# EAGLE design carte_ascenseur (EAGLE 6.1)
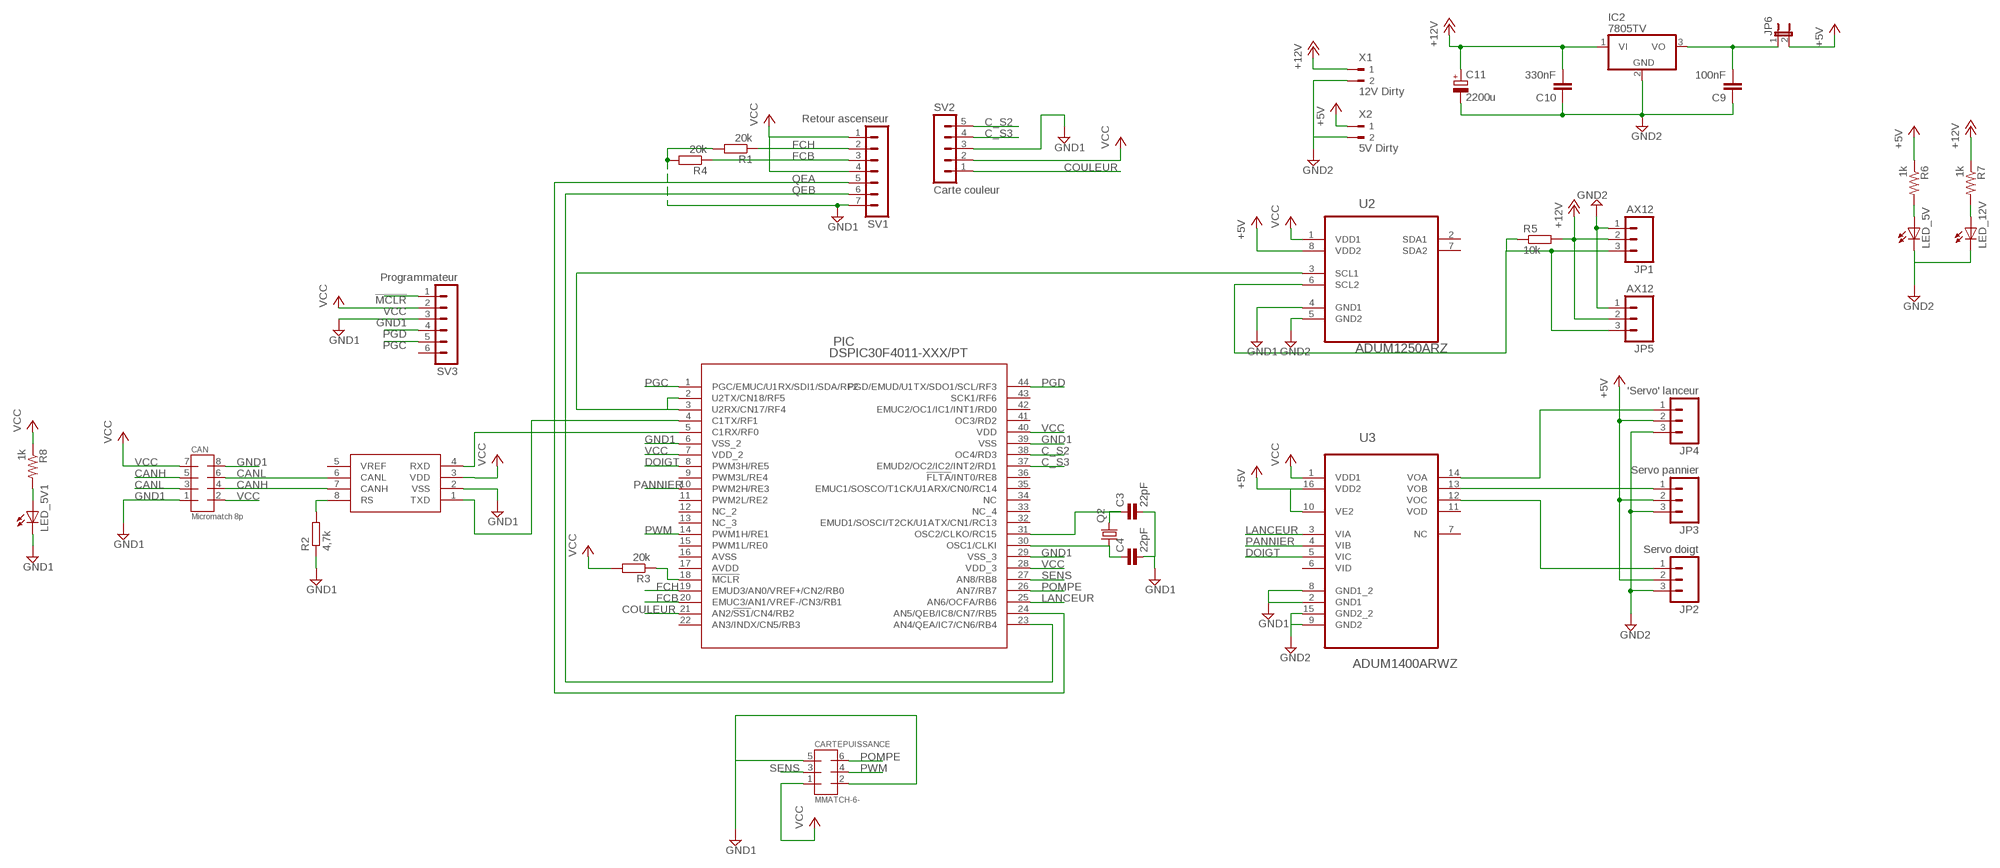
[diagram p0: schematic, sheet 1]

## Parts
C3  22pF  C0805  [0805]
C4  22pF  C0805  [0805]
C9  100nF  C-EUC0805  [C0805]
C10  330nF  C-EUC0805  [C0805]
C11  2200u  CPOL-EUTT5D11  [TT5D11]
CAN  Micromatch 8p  MMATCH-8-PTH  [AMP-215079-8]
CARTEPUISSANCE  MMATCH-6-  [AMP-215079-6]
IC2  7805TV  [TO220V]
JP1  AX12  M03POLAR  [MOLEX-1X3]
JP2  Servo doigt  M03PTH  [1X03]
JP3  Servo pannier  M03PTH  [1X03]
JP4  'Servo' lanceur  M03PTH  [1X03]
JP5  AX12  M03POLAR  [MOLEX-1X3]
JP6  JP1E  [JP1]
LED_5V  LEDCHIPLED_0805  [CHIPLED_0805]
LED_5V1  LEDCHIPLED_0805  [CHIPLED_0805]
LED_12V  LEDCHIPLED_0805  [CHIPLED_0805]
PIC  DSPIC30F4011-XXX/PT  [TQFP44_MC]
Q2  CRYSTALHC49S  [HC49/S]
R1  20k  R-EU_M0805  [M0805]
R2  4,7k  R-EU_M0805  [M0805]
R3  20k  R-EU_M0805  [M0805]
R4  20k  R-EU_M0805  [M0805]
R5  10k  R-EU_M0805  [M0805]
R6  1k  RESISTOR0805-RES  [0805]
R7  1k  RESISTOR0805-RES  [0805]
R8  1k  RESISTOR0805-RES  [0805]
SV1  Retour ascenseur  MA07-1  [MA07-1]
SV2  Carte couleur  MA05-1  [MA05-1]
SV3  Programmateur  MA06-1  [MA06-1]
U1  MCP2551  [SO08]
U2  ADUM1250ARZ  [SOIC127P600X175-8N]
U3  ADUM1400ARWZ  [SOIC127P1032X265-16N]
X1  12V Dirty  90-2  [90-2]
X2  5V Dirty  90-2  [90-2]

## Nets
!MCLR!: PIC.18(!MCLR!) R3.1 SV3.1
+5V: JP2.2 JP3.2 JP4.2 JP6.2 R6.1 U2.8(VDD2) U3.10(VE2) U3.16(VDD2) X2.1
+12V: C10.2 C11.+ IC2.1(VI) JP1.2 JP5.2 R5.2 R7.1 X1.1
C_S2: PIC.38(OC4/RD3) SV2.5
C_S3: PIC.37(EMUD2/OC2/IC2/INT2/RD1) SV2.4
CANH: CAN.4 CAN.5 U1.7(CANH)
CANL: CAN.3 CAN.6 U1.6(CANL)
COULEUR: PIC.21(AN2/!SS1!/CN4/RB2) SV2.1
DOIGT: PIC.8(PWM3H/RE5) U3.5(VIC)
FCB: PIC.20(EMUC3/AN1/VREF-/CN3/RB1) R4.1 SV1.3
FCH: PIC.19(EMUD3/AN0/VREF+/CN2/RB0) R1.1 SV1.2
GND1: C3.2 C4.2 CAN.1 CAN.8 CARTEPUISSANCE.2 CARTEPUISSANCE.5 LED_5V1.C PIC.6(VSS_2) PIC.29(VSS_3) PIC.39(VSS) R1.2 R2.1 R4.2 SV1.7 SV2.3 SV3.3 U1.2(VSS) U2.4(GND1) U3.2(GND1) U3.8(GND1_2)
GND2: C9.1 C10.1 C11.- IC2.2(GND) JP1.1 JP2.3 JP3.3 JP4.3 JP5.1 LED_5V.C LED_12V.C U2.5(GND2) U3.9(GND2) U3.15(GND2_2) X1.2 X2.2
LANCEUR: PIC.25(AN6/OCFA/RB6) U3.3(VIA)
N$1: PIC.4(C1TX/RF1) U1.1(TXD)
N$2: LED_5V.A R6.2
N$3: PIC.5(C1RX/RF0) U1.4(RXD)
N$4: R2.2 U1.8(RS)
N$6: C9.2 IC2.3(VO) JP6.1
N$7: PIC.2(U2TX/CN18/RF5) PIC.3(U2RX/CN17/RF4) U2.3(SCL1)
N$8: JP4.1 U3.14(VOA)
N$9: JP3.1 U3.13(VOB)
N$10: JP2.1 U3.12(VOC)
N$11: LED_12V.A R7.2
N$12: LED_5V1.A R8.2
N$15: C3.1 PIC.31(OSC2/CLKO/RC15) Q2.2
N$16: JP1.3 JP5.3 R5.1 U2.6(SCL2)
N$18: C4.1 PIC.30(OSC1/CLKI) Q2.1
PANNIER: PIC.10(PWM2H/RE3) U3.4(VIB)
PGC: PIC.1(PGC/EMUC/U1RX/SDI1/SDA/RF2) SV3.5
PGD: PIC.44(PGD/EMUD/U1TX/SDO1/SCL/RF3) SV3.4
POMPE: CARTEPUISSANCE.6 PIC.26(AN7/RB7)
PWM: CARTEPUISSANCE.4 PIC.14(PWM1H/RE1)
QEA: PIC.24(AN5/QEB/IC8/CN7/RB5) SV1.5
QEB: PIC.23(AN4/QEA/IC7/CN6/RB4) SV1.6
SENS: CARTEPUISSANCE.3 PIC.27(AN8/RB8)
VCC: CAN.2 CAN.7 CARTEPUISSANCE.1 PIC.7(VDD_2) PIC.28(VDD_3) PIC.40(VDD) R3.2 R8.1 SV1.1 SV1.4 SV2.2 SV3.2 U1.3(VDD) U2.1(VDD1) U3.1(VDD1)
Unconnected: PIC.9(PWM3L/RE4) PIC.11(PWM2L/RE2) PIC.12(NC_2) PIC.13(NC_3) PIC.15(PWM1L/RE0) PIC.16(AVSS) PIC.17(AVDD) PIC.22(AN3/INDX/CN5/RB3) PIC.32(EMUD1/SOSCI/T2CK/U1ATX/CN1/RC13) PIC.33(NC_4) PIC.34(NC) PIC.35(EMUC1/SOSCO/T1CK/U1ARX/CN0/RC14) PIC.36(!FLTA!/INT0/RE8) PIC.41(OC3/RD2) PIC.42(EMUC2/OC1/IC1/INT1/RD0) PIC.43(SCK1/RF6) SV3.6 U1.5(VREF) U2.2(SDA1) U2.7(SDA2) U3.6(VID) U3.7(NC) U3.11(VOD)

## Library data of the parts
C3 C4 = mbed-rlcq:C
C9 C10 = rcl:C-EU: CAPACITOR, European symbol
C11 = rcl:CPOL-EU: POLARIZED CAPACITOR, European symbol
CAN = jt-con-micromatch:MMATCH-8-*: AMP Micromatch 8-pin
CARTEPUISSANCE = jt-con-micromatch:MMATCH-6-*
IC2 = linear:78*: Positive VOLTAGE REGULATOR Source: http://cache.national.com/ds/LM/LM78L05.pdf http://www.fairchildsemi.com/ds/LM/LM7805.pdf
JP1-JP5 = SparkFun-Connectors:M03: Header 3 Standard 3-pin 0.1" header. Use with straight break away headers (SKU : PRT-00116), right angle break away headers (PRT-00553), swiss pins (PRT-00743), machine pins (PRT-00117), and female headers (PRT-00115). Molex polarized connector foot print use with SKU : PRT-08232 with associated crimp pins and housings.
JP6 = jumper:JP1E: JUMPER
LED_5V LED_5V1 LED_12V = adafruit:LED: LED OSRAM: - CHIPLED LG R971, LG N971, LY N971, LG Q971, LY Q971, LO R971, LY R971 LH N974, LH R974 LS Q976, LO Q976, LY Q976 LO Q996 - Hyper CHIPLED LW Q18S LB Q993, LB Q99A, LB R99A - SideLED LS A670, LO A670, LY A670, LG A670, LP A670 LB A673, LV A673, LT A673, LW A673 LH A674 LY A675 LS A676, LA A676, LO A676, LY A676, LW A676 LS A679, LY A679, LG A679 - Hyper Micro SIDELED® LS Y876, LA Y876, LO Y876, LY Y876 LT Y87S - SmartLED LW L88C, LW L88S LB L89C, LB L89S, LG L890 LS L89K, LO L89K, LY L89K LS L896, LA L896, LO L896, LY L896 - TOPLED LS T670, LO T670, LY T670, LG T670, LP T670 LSG T670, LSP T670, LSY T670, LOP T670, LYG T670 LG T671, LOG T671, LSG T671 LB T673, LV T673, LT T673, LW T673 LH T674 LS T676, LA T676, LO T676, LY T676, LB T676, LH T676, LSB T676, LW T676 LB T67C, LV T67C, LT T67C, LS T67K, LO T67K, LY T67K, LW E67C LS E67B, LA E67B, LO E67B, LY E67B, LB E67C, LV E67C, LT E67C LW T67C LS T679, LY T679, LG T679 LS T770, LO T770, LY T770, LG T770, LP T770 LB T773, LV T773, LT T773, LW T773 LH T774 LS E675, LA E675, LY E675, LS T675 LS T776, LA T776, LO T776, LY T776, LB T776 LHGB T686 LT T68C, LB T68C - Hyper Mini TOPLED® LB M676 - Mini TOPLED Santana® LG M470 LS M47K, LO M47K, LY M47K Source: http://www.osram.convergy.de/
PIC = UL-PIC:DSPIC30F4011-XXX/PT
Q2 = crystal:CRYSTAL: CRYSTAL; OC_FARNELL: 1667008; OC_NEWARK: unknown
R1-R5 = rcl:R-EU_: RESISTOR, European symbol
R6-R8 = SparkFun-Passives:RESISTOR: Resistor Basic schematic elements and footprints for 0603, 1206, and PTH resistors.; OC_FARNELL: unknown
SV1 = con-lstb:MA07-1: PIN HEADER; OC_FARNELL: unknown; OC_NEWARK: unknown
SV2 = con-lstb:MA05-1: PIN HEADER; OC_FARNELL: unknown; OC_NEWARK: unknown
SV3 = con-lstb:MA06-1: PIN HEADER; OC_FARNELL: unknown; OC_NEWARK: unknown
U1 = SparkFun-DigitalIC:MCP2551: CAN transceiver
U2 = Analog Devices_By_element14_Batch_1:ADUM1250ARZ: Hot Swappable, Dual I2C Isolators; MPN: ADUM1250ARZ; OC_FARNELL: 1814353; OC_NEWARK: 27M9880; PACKAGE: SOIC-8; SUPPLIER: Analog Devices
U3 = Analog Devices_By_element14_Batch_1:ADUM1400ARWZ: Quad-Channel Digital Isolators; MPN: ADUM1400ARWZ; OC_FARNELL: 1226217; OC_NEWARK: 19M8755; PACKAGE: SOIC-16; SUPPLIER: Analog Devices
X1 X2 = con-weidmueller-sl35:90-2: WEIDMUELLER CLAMP CONNECTOR; OC_FARNELL: unknown; OC_NEWARK: unknown

## Board
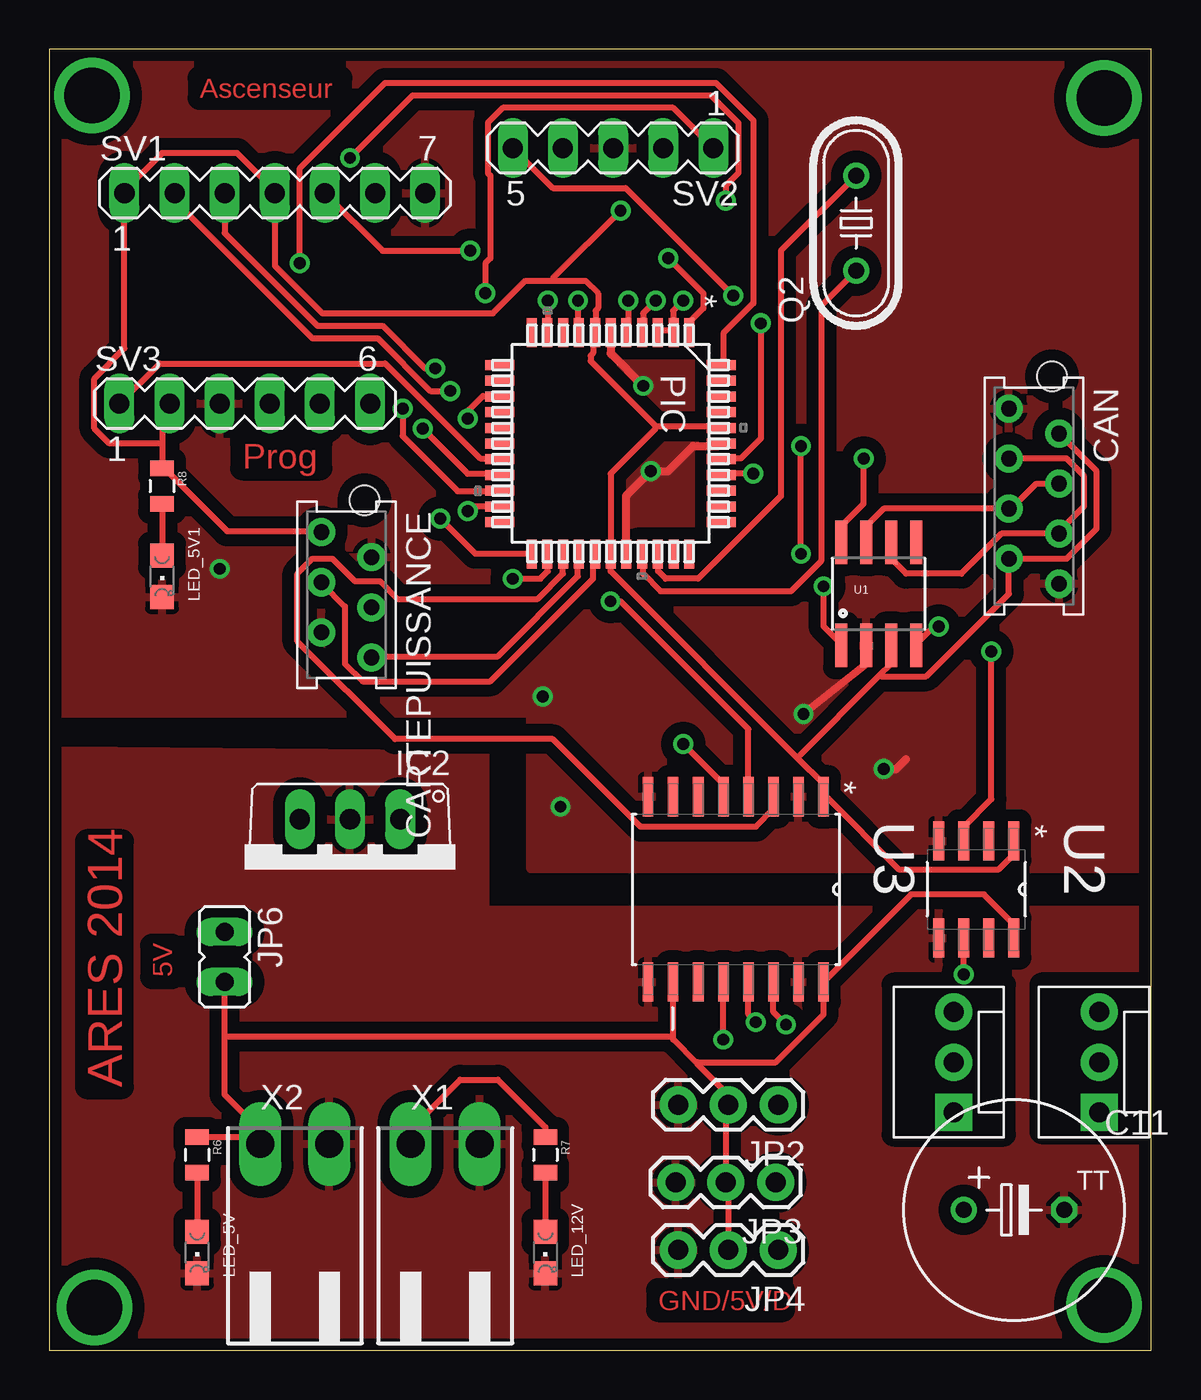
[diagram p1: board, top side]
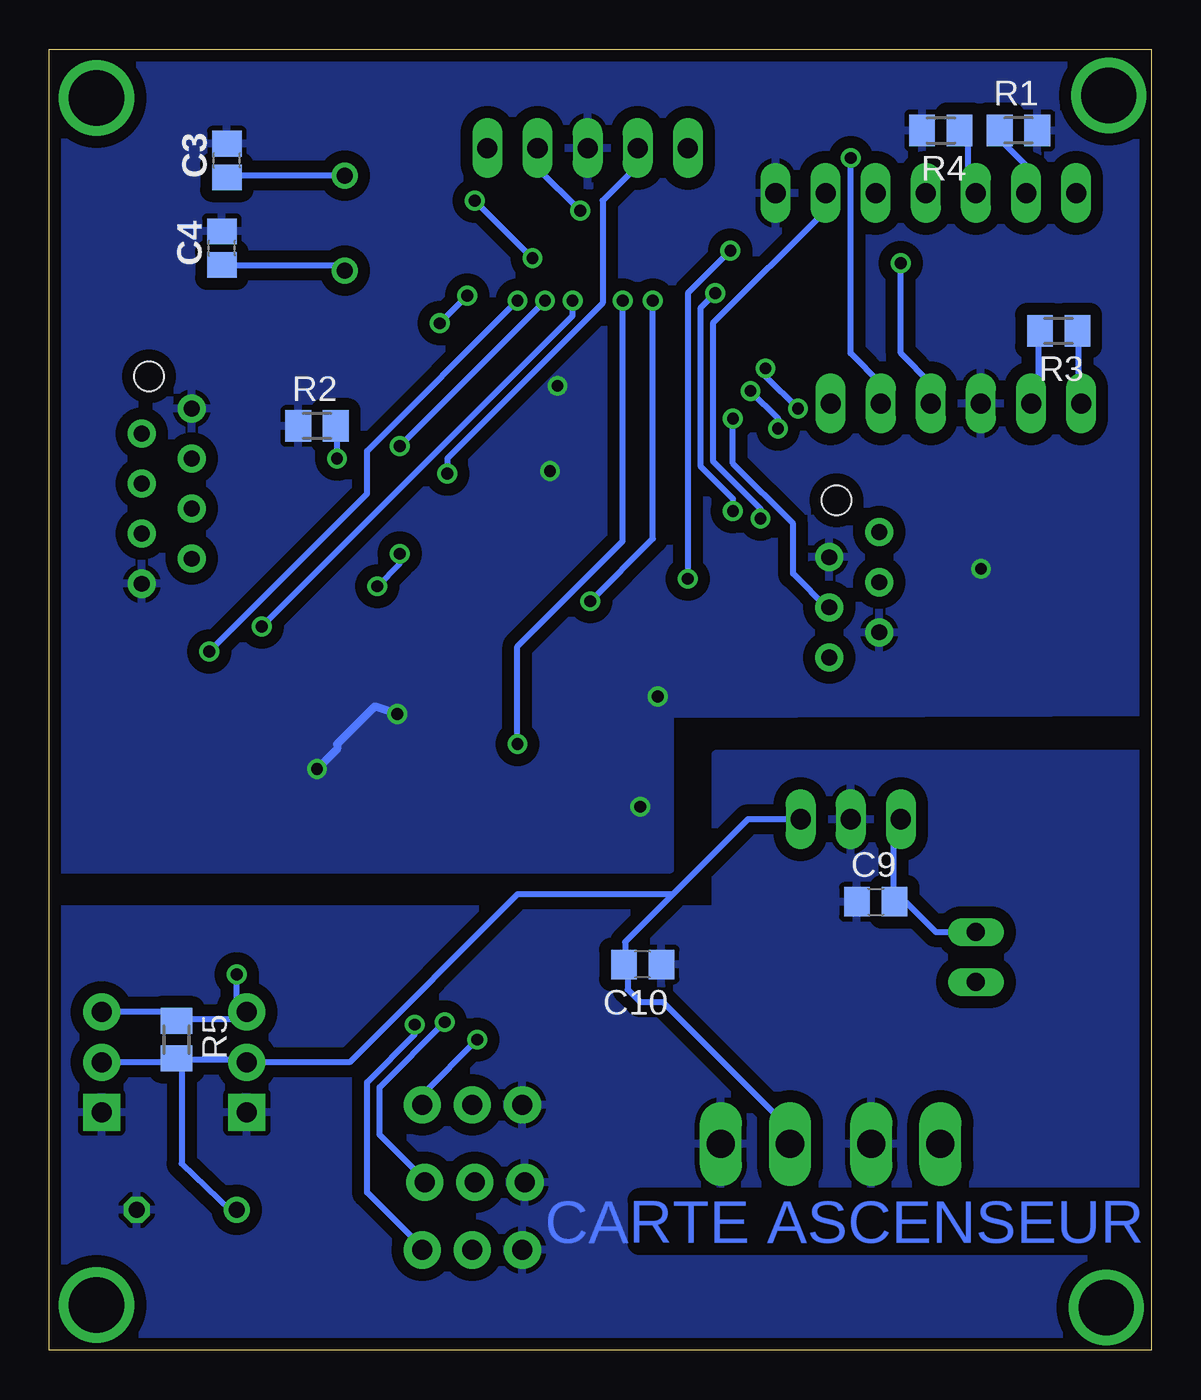
[diagram p2: board, bottom side, seen from below]

Size 55.86 x 65.96 mm. Coordinates in mm from the lower left corner, seen from the top.
Outline: 0,0 55.86,0 55.86,65.96 0,65.96 0,0
Copper layers (1*16): Top 0.035mm / dielectric 1.5mm / Bottom 0.035mm
Design rules "default": minimum track width 0.3mm, minimum drill 0.6mm, track to track 0.3mm, track to pad 0.3mm, pad to pad 0.3mm, via to via 0.3mm, smd to smd 8mil, copper to edge 0.4mm, drill to drill 8mil, minimum pad ring 10mil, minimum via ring 8mil, stop-mask expansion 4mil, vias tented up to drill 0mil, thermal gap 10mil
tRestrict: area 42.8,10.9 to 48.4,18.5; area 50.3,11 to 55.9,18.5
vRestrict: area 39.8,36.6 to 44.3,40.4; area 29.6,19.6 to 40.1,27.2; area 44.5,21.3 to 49.4,25.4; area 22.1,39.6 to 34.8,52.3

### Footprints (pad centres in the part's own frame; a part is rotated, then mirrored left to right if it is on the bottom)
0805 = smd 1.3 x 1.5: 1 -0.85,0; 2 0.85,0
C0805 = smd 1.3 x 1.5: 1 -0.95,0; 2 0.95,0
TT5D11 = drill 0.813: + -2.54,0 | drill 0.813 octagon: - 2.54,0
AMP-215079-8 = drill 0.8 pad 1.422: 1 0,-1.27; 2 1.27,1.27; 3 2.54,-1.27; 4 3.81,1.27; 5 5.08,-1.27; 6 6.35,1.27; 7 7.62,-1.27; 8 8.89,1.27 | hole 1.5: -1.62,0.905
AMP-215079-6 = drill 0.8 pad 1.422: 1 0,0; 2 1.27,2.54; 3 2.54,0; 4 3.81,2.54; 5 5.08,0; 6 6.35,2.54 | hole 1.5: -1.62,2.175
TO220V = drill 1.016 long: 1 -2.54,-2.54; 2 0,-2.54; 3 2.54,-2.54
MOLEX-1X3 = drill 1.016 pad 1.88 square: 1 0,0 | drill 1.016 pad 1.88: 2 2.54,0; 3 5.08,0
1X03 = drill 1.016 pad 1.88: 1 0,0; 2 2.54,0; 3 5.08,0
JP1 = drill 0.914 long: 1 0,-1.27; 2 0,1.27
CHIPLED_0805 = smd 1.2 x 1.2: A 0,-1.05; C 0,1.05
TQFP44_MC = smd 1.473 x 0.508: 1 -5.613,3.988; 2 -5.613,3.2; 3 -5.613,2.388; 4 -5.613,1.6; 5 -5.613,0.787; 6 -5.613,0; 7 -5.613,-0.787; 8 -5.613,-1.6; 9 -5.613,-2.388; 10 -5.613,-3.2; 11 -5.613,-3.988; 23 5.613,-3.988; 24 5.613,-3.2; 25 5.613,-2.388; 26 5.613,-1.6; 27 5.613,-0.787; 28 5.613,0; 29 5.613,0.787; 30 5.613,1.6; 31 5.613,2.388; 32 5.613,3.2; 33 5.613,3.988 | smd 0.508 x 1.473: 12 -3.988,-5.613; 13 -3.2,-5.613; 14 -2.388,-5.613; 15 -1.6,-5.613; 16 -0.787,-5.613; 17 0,-5.613; 18 0.787,-5.613; 19 1.6,-5.613; 20 2.388,-5.613; 21 3.2,-5.613; 22 3.988,-5.613; 34 3.988,5.613; 35 3.2,5.613; 36 2.388,5.613; 37 1.6,5.613; 38 0.787,5.613; 39 0,5.613; 40 -0.787,5.613; 41 -1.6,5.613; 42 -2.388,5.613; 43 -3.2,5.613; 44 -3.988,5.613
HC49/S = drill 0.813: 1 -2.413,0; 2 2.413,0
M0805 = smd 1.3 x 1.6: 1 -0.95,0; 2 0.95,0
0805' = smd 0.8 x 1.2: 1 -0.9,0; 2 0.9,0
MA07-1 = drill 1.016 long: 1 -7.62,0; 2 -5.08,0; 3 -2.54,0; 4 0,0; 5 2.54,0; 6 5.08,0; 7 7.62,0
MA05-1 = drill 1.016 long: 1 -5.08,0; 2 -2.54,0; 3 0,0; 4 2.54,0; 5 5.08,0
MA06-1 = drill 1.016 long: 1 -6.35,0; 2 -3.81,0; 3 -1.27,0; 4 1.27,0; 5 3.81,0; 6 6.35,0
SO08 = smd 0.61 x 2.21: 1 -1.905,-2.616; 2 -0.635,-2.616; 3 0.635,-2.616; 4 1.905,-2.616; 5 1.905,2.616; 6 0.635,2.616; 7 -0.635,2.616; 8 -1.905,2.616
SOIC127P600X175-8N = smd 1.981 x 0.559: 1 -2.464,1.905; 2 -2.464,0.635; 3 -2.464,-0.635; 4 -2.464,-1.905; 5 2.464,-1.905; 6 2.464,-0.635; 7 2.464,0.635; 8 2.464,1.905
SOIC127P1032X265-16N = smd 1.981 x 0.533: 1 -4.699,4.445; 2 -4.699,3.175; 3 -4.699,1.905; 4 -4.699,0.635; 5 -4.699,-0.635; 6 -4.699,-1.905; 7 -4.699,-3.175; 8 -4.699,-4.445; 9 4.699,-4.445; 10 4.699,-3.175; 11 4.699,-1.905; 12 4.699,-0.635; 13 4.699,0.635; 14 4.699,1.905; 15 4.699,3.175; 16 4.699,4.445
90-2 = drill 1.422 long: 1 -1.75,5.25; 2 1.75,5.25

### Placement (x,y rotation side)
C3  46.86,60.32 90 bottom
C4  47.12,55.88 90 bottom
C9  13.97,22.73 0 bottom
C10  25.78,19.56 180 bottom
C11  48.89,7.11 0 top
CAN  49.91,47.75 270 top
CARTEPUISSANCE  13.79,41.48 270 top
IC2  15.24,24.38 180 top
JP1  53.21,12.06 90 top
JP2  36.96,12.45 180 top
JP3  36.83,8.51 180 top
JP4  36.96,5.08 180 top
JP5  45.85,12.06 90 top
JP6  8.89,19.94 180 top
LED_5V  7.49,4.95 180 top
LED_5V1  5.71,39.24 180 top
LED_12V  25.15,4.95 180 top
PIC  28.45,45.97 270 top
Q2  40.89,57.15 90 top
R1  6.73,61.85 0 bottom
R2  42.29,46.86 0 bottom
R3  4.7,51.69 180 bottom
R4  10.67,61.85 180 bottom
R5  49.4,15.75 270 bottom
R6  1k  [0805']  7.49,9.91 270 top
R7  1k  [0805']  25.15,9.91 270 top
R8  1k  [0805']  5.71,43.81 270 top
SV1  11.43,58.67 0 top
SV2  28.57,60.96 180 top
SV3  9.91,48.01 0 top
U1  42.04,38.35 0 top
U2  46.99,23.37 270 top
U3  34.8,23.37 270 top
X1  20.07,5.21 0 top
X2  12.45,5.21 0 top

### Tracks (layer width: path | path; a pad name or v marks a point on that pad's centre or on a via)
!MCLR!
  Top 0.3: SV3.1 5.59,50.04 17.02,50.04 21.84,45.21 22.73,45.21 PIC.18
  Bottom 0.3: SV3.1 3.68,48.13 3.68,51.69 R3.1
+5V
  Top 0.3: R6.1 7.49,10.79 10.41,10.79 10.67,10.54 X2.1 9.91,10.92 9.91,11.94 8.89,12.95 8.89,15.88 | 8.89,15.88 JP6.2 | U2.8 48.89,21.59 47.37,23.11 43.69,23.11 U3.16 39.24,17.02 36.83,14.61 32.89,14.61 32.83,14.54 | 31.62,15.88 31.62,15.75 32.83,14.54 | 31.62,15.88 U3.10 | 32.83,14.54 34.42,12.95 JP2.2 34.29,12.45 JP3.2 34.42,8.51 JP4.2 | 31.62,15.88 8.89,15.88
+12V
  Top 0.3: R7.1 25.15,11.3 22.73,13.72 20.83,13.72 18.42,11.3 18.42,10.54 X1.1
  Bottom 0.3: R5.2 49.4,14.73 45.97,14.73 JP5.2 40.64,14.61 32.13,23.11 24.38,23.11 24.32,23.05 | C11.+ 46.68,7.1 49.15,9.46 49.15,14.61 R5.2 | JP1.2 49.4,14.61 R5.2 | 24.32,23.05 20.45,26.92 IC2.1 | 24.32,23.05 26.67,20.7 26.67,19.56 C10.2 26.54,19.56 26.54,18.29 25.91,17.65 24.76,17.65 18.42,11.3 18.42,10.54 X1.1
C_S2  (via drill 0.6)
  Top 0.3: v36.07,52.07 36.07,46.23 35.05,45.21 34.16,45.21 PIC.38 | v34.67,53.47 29.21,58.93 25.53,58.93 SV2.5
  Bottom 0.3: v34.67,53.47 v36.07,52.07
C_S3  (via drill 0.6)
  Top 0.3: v35.69,44.45 34.16,44.45 PIC.37
  Bottom 0.3: v35.69,44.45 35.69,45.21 27.81,53.09 27.81,58.29 26.04,60.07 SV2.4
CANH
  Top 0.3: U1.7 41.4,41.78 42.29,42.67 CAN.5 48.77,42.67 50.04,43.94 CAN.4
CANL
  Top 0.3: U1.6 42.67,40.13 43.43,39.37 46.23,39.37 48.26,41.4 CAN.6 51.18,41.53 52.45,42.8 52.45,44.32 51.56,45.21 CAN.3
COULEUR  (via drill 0.6)
  Top 0.3: v21.21,42.55 21.46,42.8 22.73,42.8 PIC.21 | v22.1,53.59 22.1,55.12 22.35,55.37 22.35,59.56 22.22,59.69 22.22,62.23 22.99,62.99 31.62,62.99 SV2.1
  Bottom 0.3: v21.21,42.55 21.21,43.18 22.86,44.83 22.86,52.83 v22.1,53.59
DOIGT  (via drill 0.6)
  Top 0.3: v26.8,53.21 26.8,51.69 PIC.8 | v32.13,30.73 34.16,28.7 U3.5
  Bottom 0.3: v26.8,53.21 26.8,41.02 32.13,35.69 v32.13,30.73
FCB  (via drill 0.6)
  Top 0.3: v17.91,47.75 17.91,46.35 20.7,43.56 22.73,43.56 PIC.20 | v19.56,49.78 19.05,49.78 16.89,51.94 13.59,51.94 8.89,56.64 SV1.3
  Bottom 0.3: v17.91,47.75 19.56,49.4 v19.56,49.78 | SV1.3 9.27,59.05 9.27,62.36 R4.1
FCH  (via drill 0.6)
  Top 0.3: v18.92,46.74 21.21,44.45 22.73,44.45 PIC.19 | v20.32,48.64 19.3,48.64 16.64,51.31 13.33,51.31 6.35,58.29 SV1.2
  Bottom 0.3: v18.92,46.74 18.92,47.24 v20.32,48.64 | SV1.2 6.35,60.07 7.62,61.34 7.62,61.85 R1.1
GND1  (via drill 0.6)
  Top 0.406: U1.2 41.4,34.8 v38.23,32.26 | v42.29,29.46 42.93,29.46 43.43,29.97 | PIC.29 29.24,43.33 v30.48,44.58 31.37,44.58 32.64,45.85 33.93,45.85 PIC.39 | PIC.6 28.45,50.55 v30.1,48.89
  Bottom 0.406: v38.23,32.26 39.37,32.64 41.28,30.73 41.28,30.48 v42.29,29.46
  other vias: 25.91,27.56 25.02,33.15 8.64,39.62
  pour Bottom (isolate 0.61): -7.87,68.45 57.15,68.33 57.15,24.38 24.38,24.38 24.38,32.26 -7.87,32.38
  pour Top (isolate 0.61): -1.78,68.33 57.15,68.33 57.15,24.38 24.38,24.38 24.38,32.26 -1.78,32.26
GND2
  pour Bottom (isolate 0.61): -1.78,30.23 22.1,30.23 22.1,22.35 57.15,22.35 57.15,-1.02 -1.78,-1.02
  pour Top (isolate 0.61): -4.57,30.48 22.1,30.23 22.1,22.35 57.15,22.35 57.15,-1.02 -1.78,-1.02
LANCEUR
  Top 0.3: U3.3 36.7,27.43 35.81,26.54 29.97,26.54 25.53,30.99 17.53,30.99 12.57,35.94 12.57,39.37 13.33,40.13 14.35,40.13 15.49,38.99 16.76,38.99 17.65,38.1 24.76,38.1 26.04,39.37 26.04,40.26 PIC.25
N$1  (via drill 0.6)
  Top 0.3: v30.73,53.21 30.1,52.58 30.1,51.69 PIC.4 | v38.1,40.39 v38.1,45.85 | v39.24,38.73 39.24,36.7 40.13,35.81 U1.1
  Bottom 0.3: v38.1,45.85 v30.73,53.21 | v38.1,40.39 38.1,39.88 v39.24,38.73
N$2
  Top 0.3: R6.2 LED_5V.A
N$3  (via drill 0.6)
  Top 0.3: v29.34,53.21 29.34,51.69 PIC.5 | v45.08,36.7 44.83,36.7 43.94,35.81 U1.4
  Bottom 0.3: v29.34,53.21 29.34,52.45 v45.08,36.7
N$4  (via drill 0.6)
  Top 0.3: v41.28,45.21 41.28,42.93 40.13,41.78 U1.8
  Bottom 0.3: v41.28,45.21 41.28,46.86 R2.2
N$6
  Bottom 0.3: IC2.3 13.08,26.54 13.08,22.73 C9.2 12.95,23.24 10.92,21.21 JP6.1
N$7  (via drill 0.6)
  Top 0.3: PIC.3 30.86,51.69 31.62,51.69 PIC.2 31.62,51.82 31.62,52.7 v32.13,53.21 | v47.75,35.43 47.75,27.94 46.35,26.54 U2.3
  Bottom 0.3: v32.13,53.21 39.75,45.59 39.75,43.43 v47.75,35.43
N$8  (via drill 0.6)
  Top 0.3: U3.14 36.7,17.14 v37.34,16.51
  Bottom 0.3: v37.34,16.51 37.34,16 39.75,13.59 39.75,8 36.96,5.21 JP4.1
N$9  (via drill 0.6)
  Top 0.3: U3.13 35.43,17.02 v35.81,16.64
  Bottom 0.3: v35.81,16.64 39.12,13.34 39.12,10.92 36.83,8.64 JP3.1
N$10  (via drill 0.6)
  Top 0.3: v34.16,15.75 U3.12
  Bottom 0.3: v34.16,15.75 36.96,12.95 JP2.1
N$11
  Top 0.3: R7.2 LED_12V.A
N$12
  Top 0.3: R8.2 LED_5V1.A
N$15
  Top 0.3: Q2.2 37.08,55.75 37.08,43.31 32.89,39.12 31.24,39.12 30.86,39.5 30.86,40.26 PIC.31
  Bottom 0.3: Q2.2 46.86,59.56 C3.1
N$16  (via drill 0.6)
  Top 0.3: v46.35,19.05 U2.6
  Bottom 0.3: v46.35,19.05 46.35,16.89 JP5.3 46.23,16.76 49.4,16.76 R5.1 49.53,16.76 49.91,17.14 JP1.3
N$18
  Top 0.3: Q2.1 39.12,52.96 39.12,40 37.59,38.48 30.99,38.48 30.1,39.37 30.1,40.26 PIC.30
  Bottom 0.3: Q2.1 41.15,54.99 47.12,54.99 C4.1
N$20  (via drill 2.8)
  other vias: 53.47,63.5
N$21  (via drill 2.8)
  other vias: 53.47,2.29
N$22  (via drill 2.8)
  other vias: 2.29,2.16
N$23  (via drill 2.8)
  other vias: 2.16,63.63
PANNIER  (via drill 0.6)
  Top 0.3: v25.27,53.21 25.27,51.69 PIC.10 | v28.45,37.97 28.96,37.97 35.43,31.5 U3.4
  Bottom 0.3: v25.27,53.21 25.27,41.15 v28.45,37.97
PGC  (via drill 0.6)
  Top 0.3: v31.37,55.37 33.15,53.59 33.15,52.83 32.51,52.2 32.51,51.69 PIC.1 | v34.29,58.29 34.29,59.05 34.92,59.69 34.92,62.23 33.53,63.63 18.42,63.63 v15.24,60.45
  Bottom 0.3: v34.29,58.29 v31.37,55.37 | v15.24,60.45 15.24,50.55 13.72,49.02 SV3.5
PGD  (via drill 0.6)
  Top 0.3: v12.7,55.12 12.7,59.94 17.02,64.26 33.78,64.26 35.69,62.36 35.69,53.09 34.16,51.56 34.16,50.04 PIC.44
  Bottom 0.3: v12.7,55.12 12.7,50.55 11.18,49.02 SV3.4
POMPE
  Top 0.3: PIC.26 26.8,40.26 26.8,39.24 22.73,35.18 16.38,35.18 CARTEPUISSANCE.6
PWM  (via drill 0.6)
  Top 0.3: v21.21,47.24 21.21,47.62 21.97,48.39 22.73,48.39 PIC.14
  Bottom 0.3: v21.21,47.24 21.21,44.96 18.16,41.91 18.16,39.37 16.38,37.59 CARTEPUISSANCE.4
QEA  (via drill 0.6)
  Top 0.3: v23.5,39.12 24.89,39.12 25.27,39.5 25.27,40.26 PIC.24 | v21.34,55.75 16.89,55.75 SV1.5
  Bottom 0.3: v23.5,39.12 23.5,53.59 v21.34,55.75
QEB  (via drill 0.6)
  Top 0.3: v19.81,42.16 21.59,40.39 24.38,40.39 PIC.23
  Bottom 0.3: v19.81,42.16 19.81,42.67 22.22,45.09 22.22,52.07 16.51,57.78 SV1.6
SENS
  Top 0.3: PIC.27 27.56,40.26 27.56,39.12 22.35,33.91 15.88,33.91 14.99,34.8 14.99,37.72 13.84,38.86 CARTEPUISSANCE.3
VCC  (via drill 0.6)
  Top 0.3: 37.91,30.04 39.24,28.7 U3.1 39.37,28.07 43.05,24.38 48.13,24.38 48.89,25.15 U2.1 | 37.91,30.04 28.45,39.5 PIC.28 28.45,44.45 30.73,46.74 30.73,46.86 | U1.3 42.67,34.8 42.1,34.23 | 37.91,30.04 42.1,34.23 | 42.1,34.23 42.16,34.16 44.45,34.16 48.64,38.35 CAN.7 51.56,40.13 53.09,41.66 53.09,44.58 CAN.2 | 5.71,45.97 5.71,47.62 SV3.2 | 5.71,45.97 R8.1 5.84,44.7 9.02,41.53 13.72,41.53 CARTEPUISSANCE.1 | 5.71,45.97 3.05,45.97 2.29,46.74 2.29,49.28 3.81,50.8 SV1.1 3.81,58.8 5.71,60.71 9.53,60.71 11.43,58.8 SV1.4 11.43,54.99 13.84,52.58 22.48,52.58 24.13,54.23 25.53,54.23 | 25.53,54.23 27.18,54.23 27.81,53.59 27.81,52.83 27.69,52.7 27.69,51.69 PIC.7 27.56,51.56 27.56,50.55 27.43,50.42 27.43,50.16 30.73,46.86 | 30.73,46.86 34.04,46.86 PIC.40 | v28.96,57.78 25.53,54.36 25.53,54.23
  Bottom 0.3: SV3.2 5.71,48.39 5.71,51.69 R3.2 | SV2.2 31.11,59.94 v28.96,57.78

### Text on the board
Top: Ascenseur | Prog | 5V | ARES 2014 | GND/5V/D
Bottom: CARTE ASCENSEUR